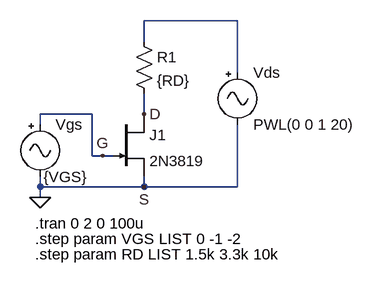
[diagram p0: schematic CircuitoCuartaParte.asc]
CircuitoCuartaParte.asc, the LTspice schematic file:
Version 4
SHEET 1 880 680
WIRE 384 -32 240 -32
WIRE 240 0 240 -32
WIRE 384 48 384 -32
WIRE 160 112 80 112
WIRE 240 112 240 80
WIRE 80 128 80 112
WIRE 160 176 160 112
WIRE 176 176 160 176
WIRE 192 176 176 176
WIRE 80 224 80 208
WIRE 240 224 240 208
WIRE 240 224 80 224
WIRE 384 224 384 128
WIRE 384 224 240 224
WIRE 80 240 80 224
FLAG 80 240 0
FLAG 176 176 G
FLAG 240 224 S
FLAG 240 112 D
SYMBOL njf 192 112 R0
SYMATTR InstName J1
SYMATTR Value 2N3819
SYMBOL Misc\\signal 80 112 R0
WINDOW 3 5 97 Left 2
WINDOW 123 0 0 Left 0
WINDOW 39 0 0 Left 0
SYMATTR Value {VGS}
SYMATTR InstName Vgs
SYMBOL Misc\\signal 384 32 R0
WINDOW 123 0 0 Left 0
WINDOW 39 0 0 Left 0
SYMATTR InstName Vds
SYMATTR Value PWL(0 0 1 20)
SYMBOL res 224 -16 R0
SYMATTR InstName R1
SYMATTR Value {RD}
TEXT 72 280 Left 2 !.tran 0 2 0 100u
TEXT 72 304 Left 2 !.step param VGS LIST 0 -1 -2
TEXT 72 328 Left 2 !.step param RD LIST 1.5k 3.3k 10k

The netlist it stands for:
* CircuitoCuartaParte.asc
J1 D G 0 2N3819
Vgs G 0 {VGS}
Vds N001 0 PWL(0 0 1 20)
R1 N001 D {RD}
.model NJF NJF
.model PJF PJF
.lib standard.jft
.tran 0 2 0 100u
.step param VGS LIST 0 -1 -2
.step param RD LIST 1.5k 3.3k 10k
.backanno
.end